# Altium schematic sheet 105358-3SC001-01-A_Cover.SchDoc: Cover- EFM 1
size 420 x 297 mm; DrawnBy: JeSa, KaKa; Organization: Hotswap Norden AB; Address1: Knarrarnäsgatan 7; Address2: SE-164 40 Kista; Address3: Sweden; DocumentNumber: 105358-3SC001-01; SheetNumber: 1; SheetTotal: 5; PageSetup: Record=PageOptions|CenterHorizontal=True|CenterVertical=True|PrintScale=0.98|XCorrection=1.00|YCorrection=1.00|PrintKind=0|BorderSize=5000000|LeftOffset=0|BottomOffset=0|Orientation=2|PaperLength=1000|PaperWidth=1000|Scale=100|PaperSource=7|PrintQuality=-3|MediaType=1|DitherType=10|PrintScaleMode=1|PaperKind=A3|PaperIndex=8
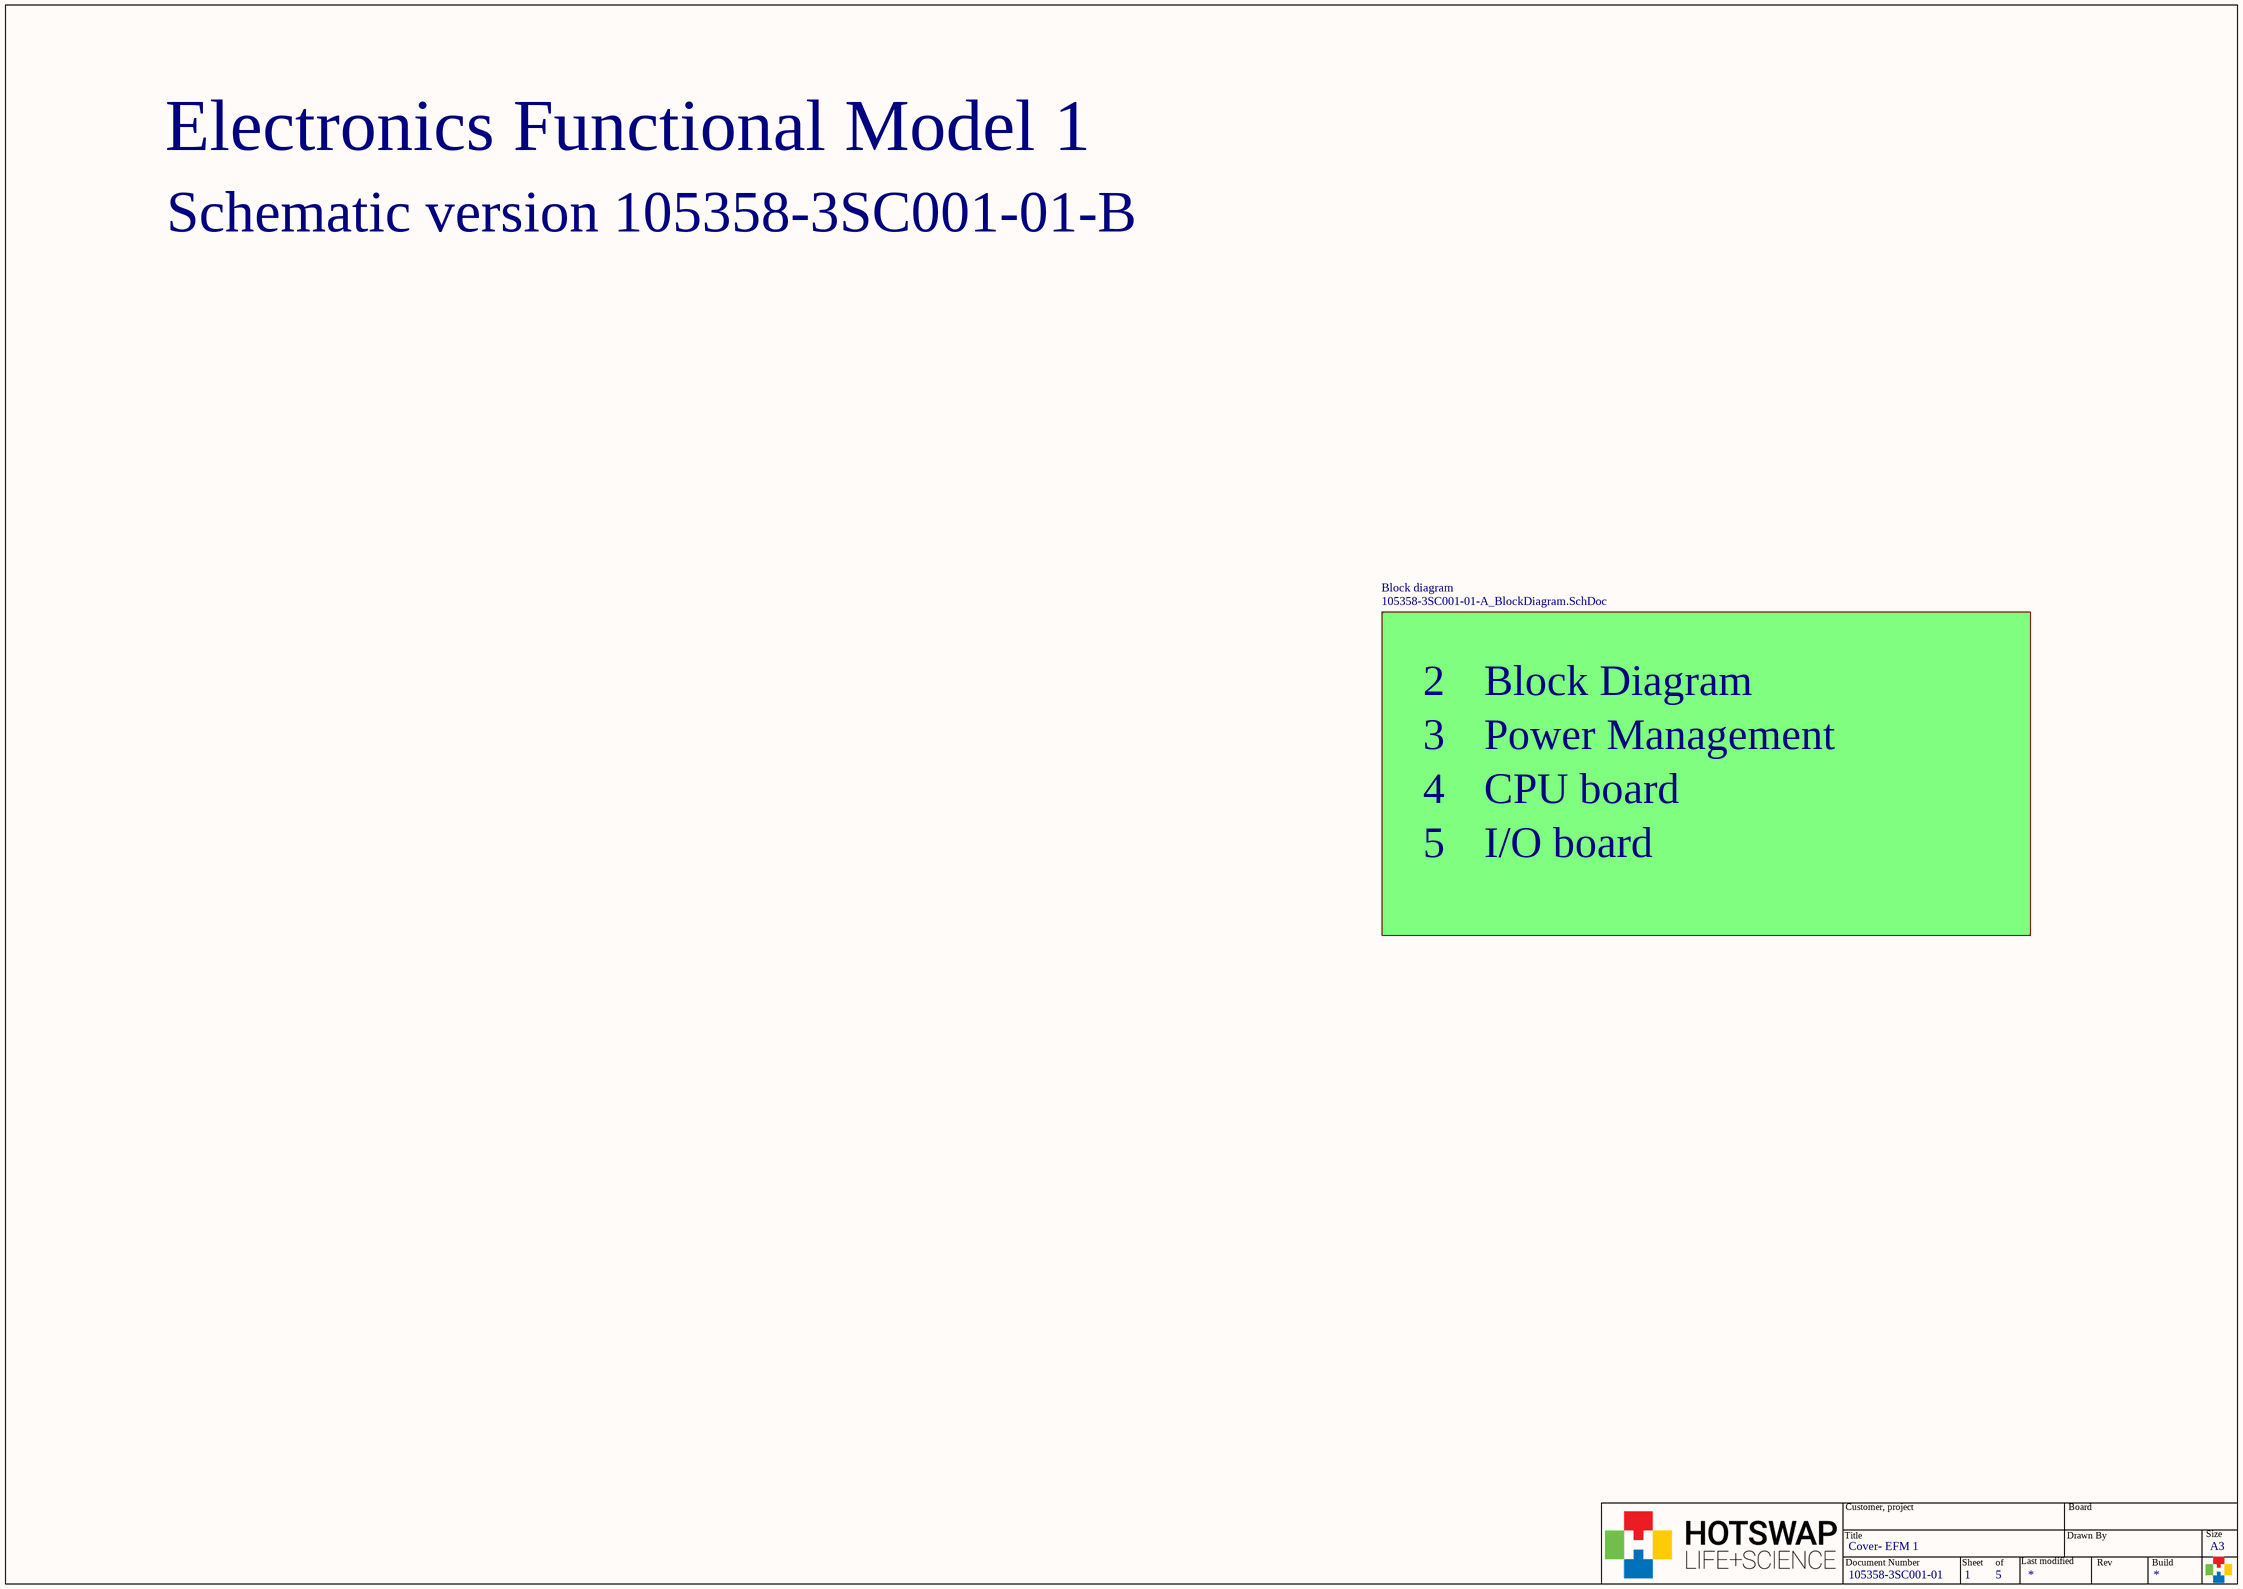
[diagram p0: 105358-3SC001-01-A_Cover.SchDoc]

## Sub-sheets
Block diagram = 105358-3SC001-01-A_BlockDiagram.SchDoc: no entries

## Notes on the sheet
- Electronics Functional Model 1
- Schematic version 105358-3SC001-01-B
- 2
- Block Diagram
- 3
- Power Management
- 4
- 5
- I/O board
- CPU board
- Title
- Customer, project
- Drawn By
- Board
- Size
- Document Number
- Sheet
- of
- Last modified
- Rev
- Build
- A3